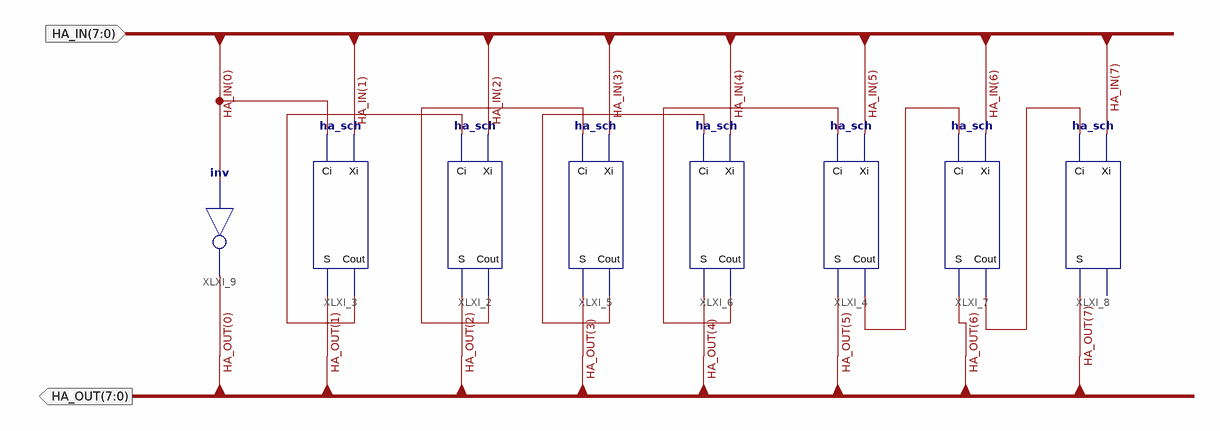
[diagram p0: schematic sheet 1]
// Xilinx ISE schematic ha8_sch.sch (spartan3e) as structural Verilog: 8 symbols, 2 ports
module ha8_sch (
  input  [7:0] HA_IN,
  output [7:0] HA_OUT
);

  wire XLXN_11, XLXN_12, XLXN_13, XLXN_14, XLXN_15, XLXN_16;

  ha_sch XLXI_2 (.Ci(XLXN_16), .Cout(XLXN_15), .S(HA_OUT[2]), .Xi(HA_IN[2]));
  ha_sch XLXI_3 (.Ci(HA_IN[0]), .Cout(XLXN_16), .S(HA_OUT[1]), .Xi(HA_IN[1]));
  ha_sch XLXI_4 (.Ci(XLXN_13), .Cout(XLXN_12), .S(HA_OUT[5]), .Xi(HA_IN[5]));
  ha_sch XLXI_5 (.Ci(XLXN_15), .Cout(XLXN_14), .S(HA_OUT[3]), .Xi(HA_IN[3]));
  ha_sch XLXI_6 (.Ci(XLXN_14), .Cout(XLXN_13), .S(HA_OUT[4]), .Xi(HA_IN[4]));
  ha_sch XLXI_7 (.Ci(XLXN_12), .Cout(XLXN_11), .S(HA_OUT[6]), .Xi(HA_IN[6]));
  ha_sch XLXI_8 (.Ci(XLXN_11), .S(HA_OUT[7]), .Xi(HA_IN[7]));  // open: Cout
  not XLXI_9 (HA_OUT[0], HA_IN[0]);
endmodule
